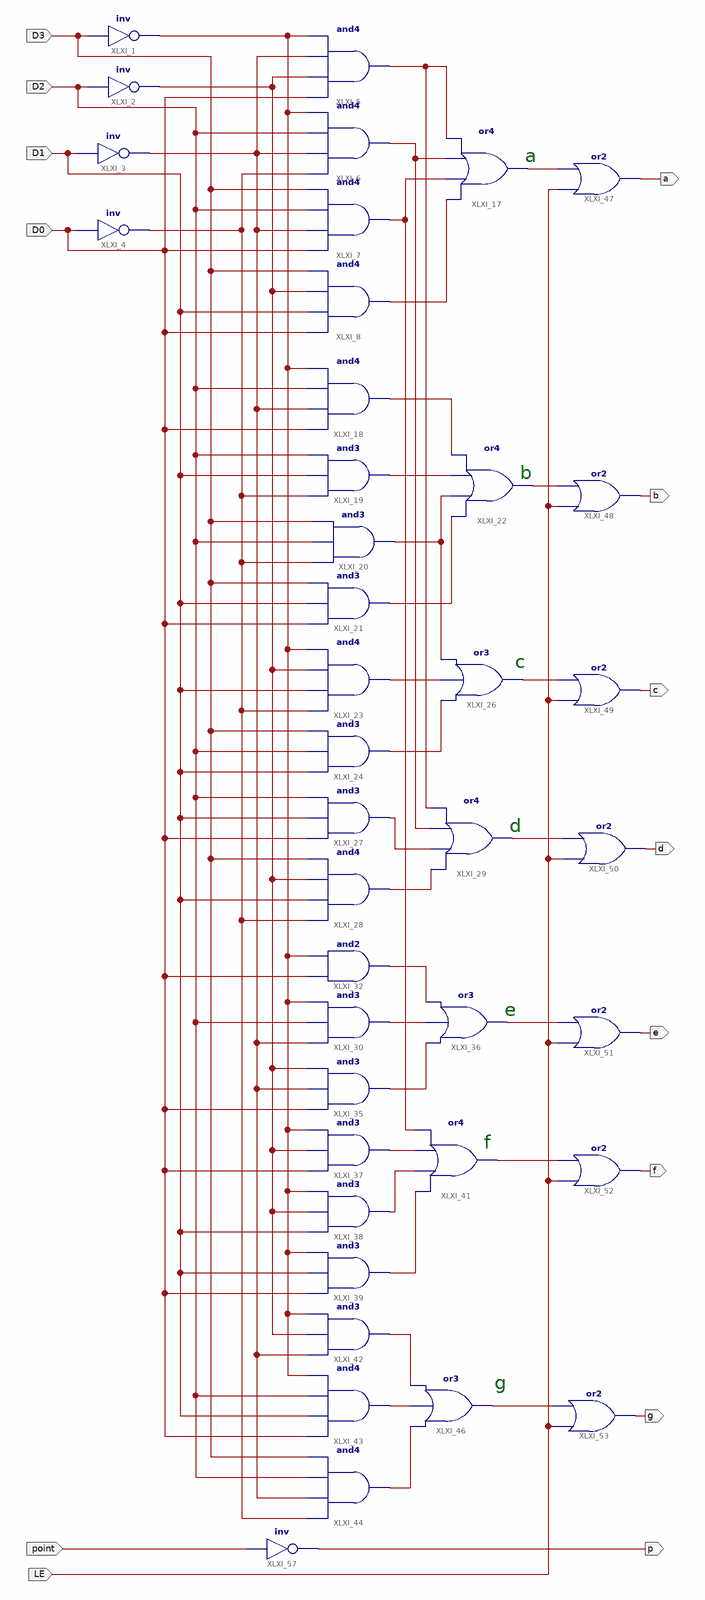
[diagram p0: schematic sheet 1]
// Xilinx ISE schematic MC14495_ZJU.sch (kintex7) as structural Verilog: 40 symbols, 14 ports
module MC14495_ZJU (
  input  D2,
  input  D1,
  input  D0,
  input  LE,
  input  point,
  input  D3,
  output a,
  output b,
  output c,
  output d,
  output e,
  output f,
  output g,
  output p
);

  wire XLXN_14, XLXN_24, XLXN_26, XLXN_27, XLXN_28, XLXN_61, XLXN_62, XLXN_72, XLXN_73, XLXN_74, XLXN_75,
       XLXN_111, XLXN_115, XLXN_119, XLXN_140, XLXN_141, XLXN_170, XLXN_171, XLXN_172, XLXN_184, XLXN_185,
       XLXN_186, XLXN_200, XLXN_201, XLXN_202, XLXN_208, XLXN_209, XLXN_210, XLXN_211, XLXN_212, XLXN_213,
       XLXN_214;

  not XLXI_1 (XLXN_14, D3);
  not XLXI_2 (XLXN_61, D2);
  not XLXI_3 (XLXN_62, D1);
  not XLXI_4 (XLXN_24, D0);
  and XLXI_5 (XLXN_119, D0, XLXN_61, XLXN_62, XLXN_14);
  and XLXI_6 (XLXN_26, XLXN_24, XLXN_62, D2, XLXN_14);
  and XLXI_7 (XLXN_27, D0, XLXN_62, D2, D3);
  and XLXI_8 (XLXN_28, D0, D1, XLXN_61, D3);
  or XLXI_17 (XLXN_208, XLXN_28, XLXN_27, XLXN_26, XLXN_119);
  and XLXI_18 (XLXN_72, D0, XLXN_62, D2, XLXN_14);
  and XLXI_19 (XLXN_73, XLXN_24, D1, D2);
  and XLXI_20 (XLXN_74, XLXN_24, D2, D3);
  and XLXI_21 (XLXN_75, D0, D1, D3);
  or XLXI_22 (XLXN_209, XLXN_75, XLXN_74, XLXN_73, XLXN_72);
  and XLXI_23 (XLXN_111, XLXN_24, D1, XLXN_61, XLXN_14);
  and XLXI_24 (XLXN_115, D1, D2, D3);
  or XLXI_26 (XLXN_210, XLXN_115, XLXN_111, XLXN_74);
  and XLXI_27 (XLXN_140, D0, D1, D2);
  and XLXI_28 (XLXN_141, XLXN_24, D1, XLXN_61, D3);
  or XLXI_29 (XLXN_211, XLXN_141, XLXN_140, XLXN_26, XLXN_119);
  and XLXI_32 (XLXN_170, D0, XLXN_14);
  and XLXI_30 (XLXN_171, XLXN_62, D2, XLXN_14);
  and XLXI_35 (XLXN_172, D0, XLXN_62, XLXN_61);
  or XLXI_36 (XLXN_212, XLXN_172, XLXN_171, XLXN_170);
  and XLXI_37 (XLXN_184, D0, XLXN_61, XLXN_14);
  and XLXI_38 (XLXN_185, D1, XLXN_61, XLXN_14);
  and XLXI_39 (XLXN_186, D0, D1, XLXN_14);
  or XLXI_41 (XLXN_213, XLXN_186, XLXN_185, XLXN_184, XLXN_27);
  and XLXI_42 (XLXN_200, XLXN_62, XLXN_61, XLXN_14);
  and XLXI_43 (XLXN_201, D0, D1, D2, XLXN_14);
  and XLXI_44 (XLXN_202, XLXN_24, XLXN_62, D2, D3);
  or XLXI_46 (XLXN_214, XLXN_202, XLXN_201, XLXN_200);
  or XLXI_47 (a, LE, XLXN_208);
  or XLXI_48 (b, LE, XLXN_209);
  or XLXI_49 (c, LE, XLXN_210);
  or XLXI_50 (d, LE, XLXN_211);
  or XLXI_51 (e, LE, XLXN_212);
  or XLXI_52 (f, LE, XLXN_213);
  or XLXI_53 (g, LE, XLXN_214);
  not XLXI_57 (p, point);

  // Notes on the sheet:
  //   a
  //   b
  //   c
  //   d
  //   e
  //   f
  //   g
endmodule
